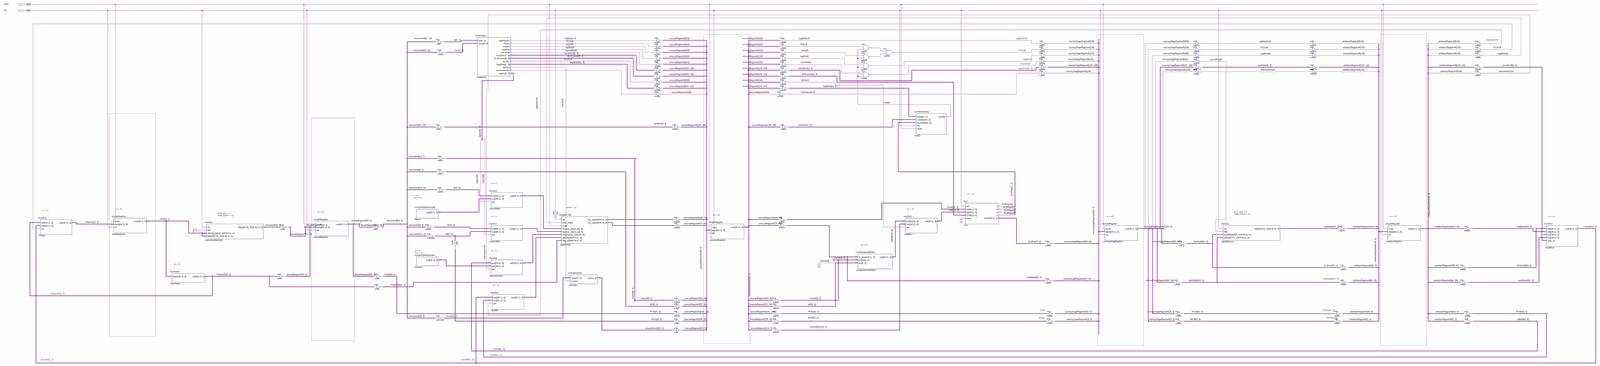
[diagram p0: schematic sheet, whole]
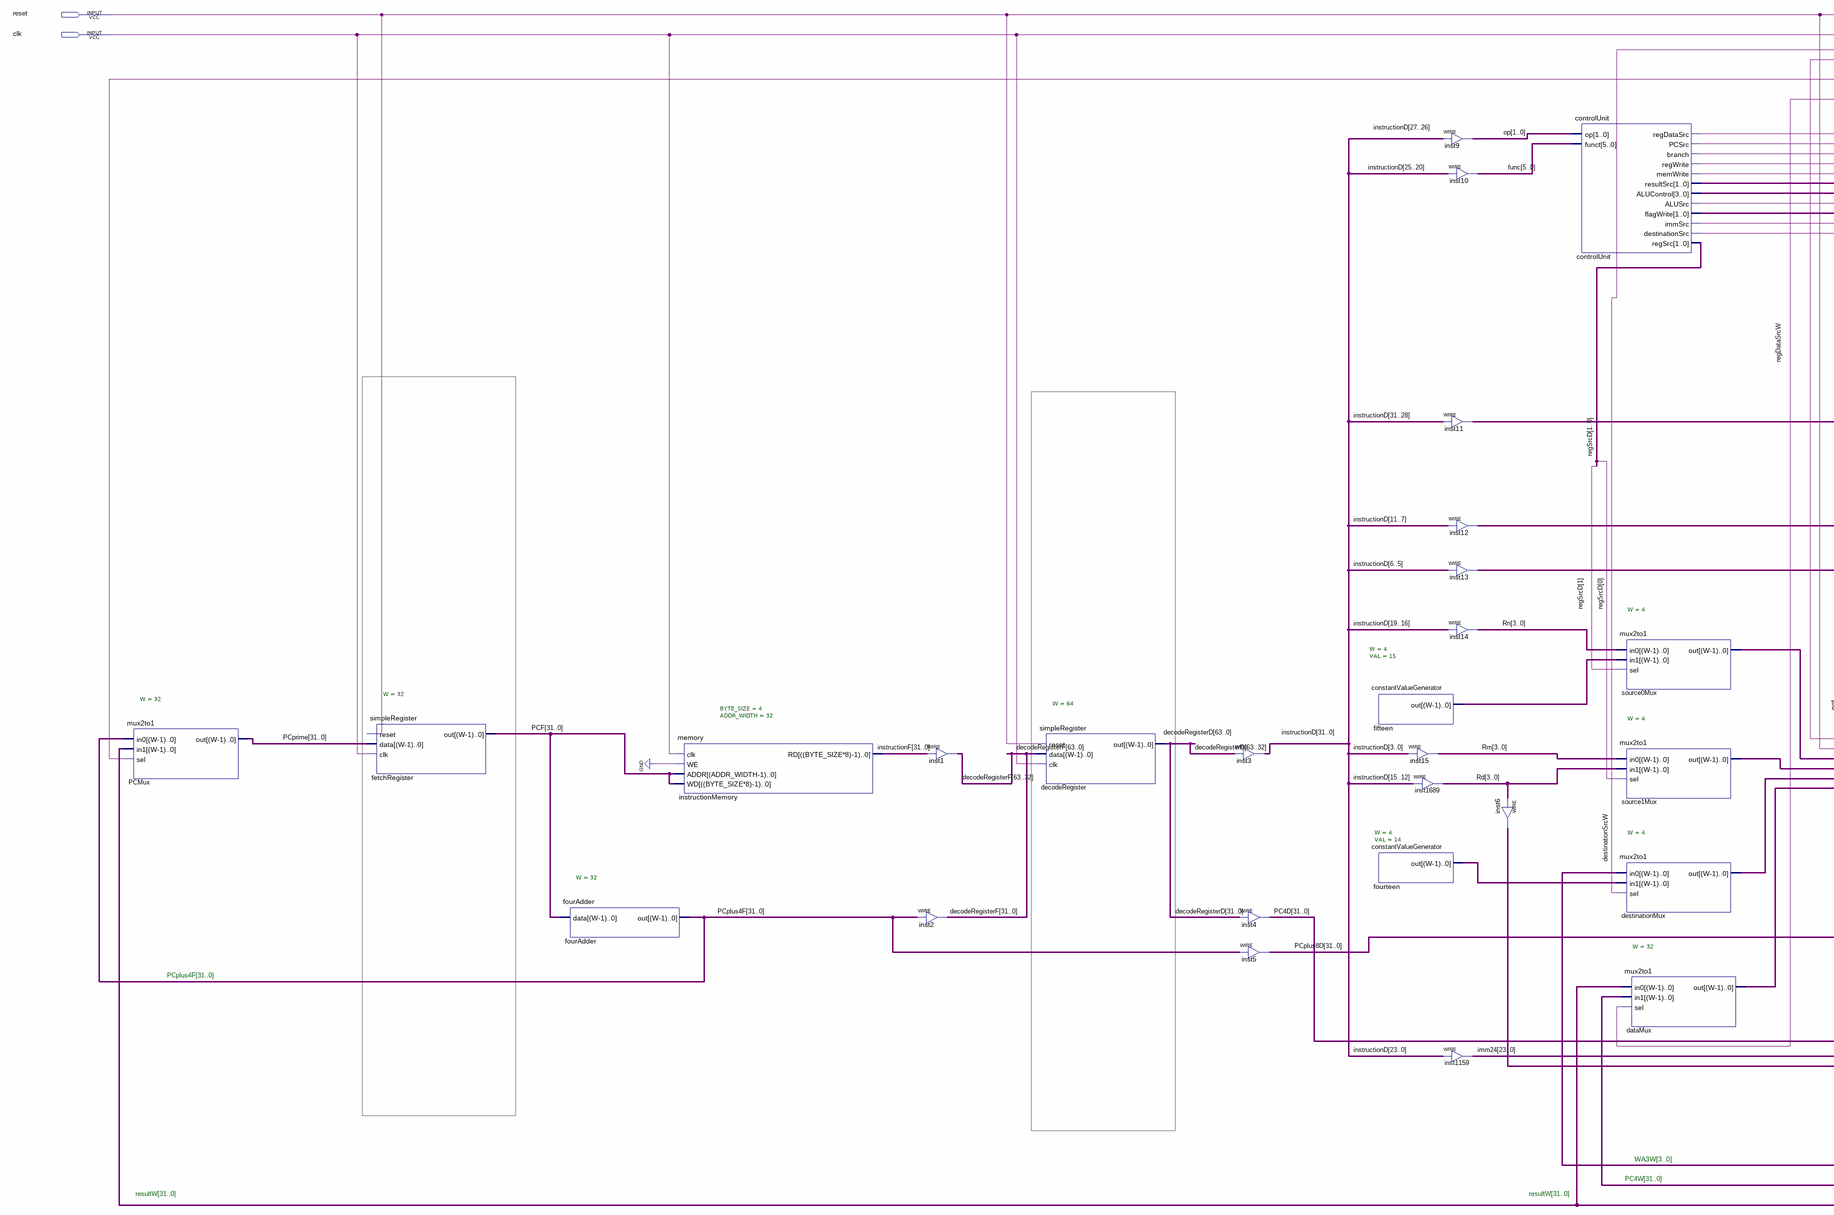
[diagram p1: schematic sheet, left part]
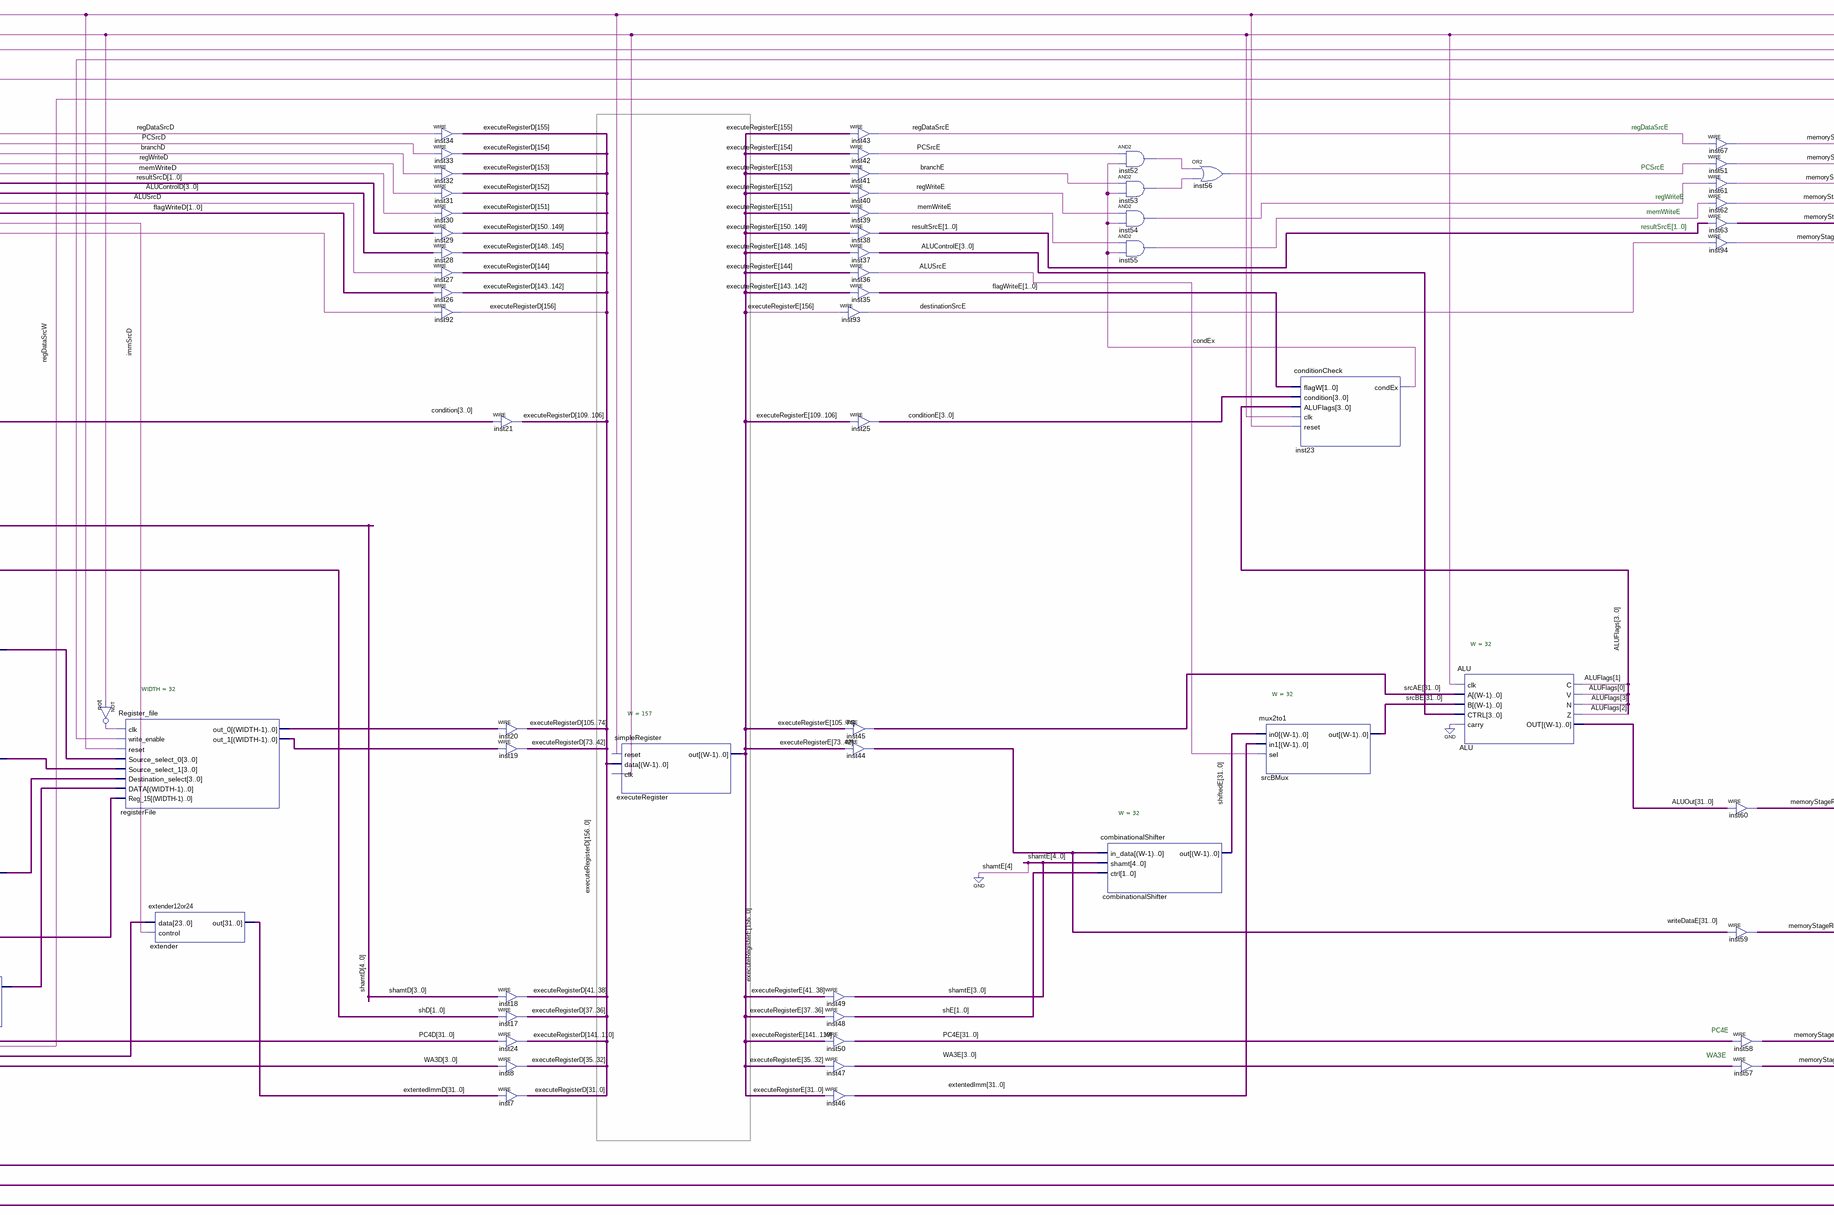
[diagram p2: schematic sheet, centre part]
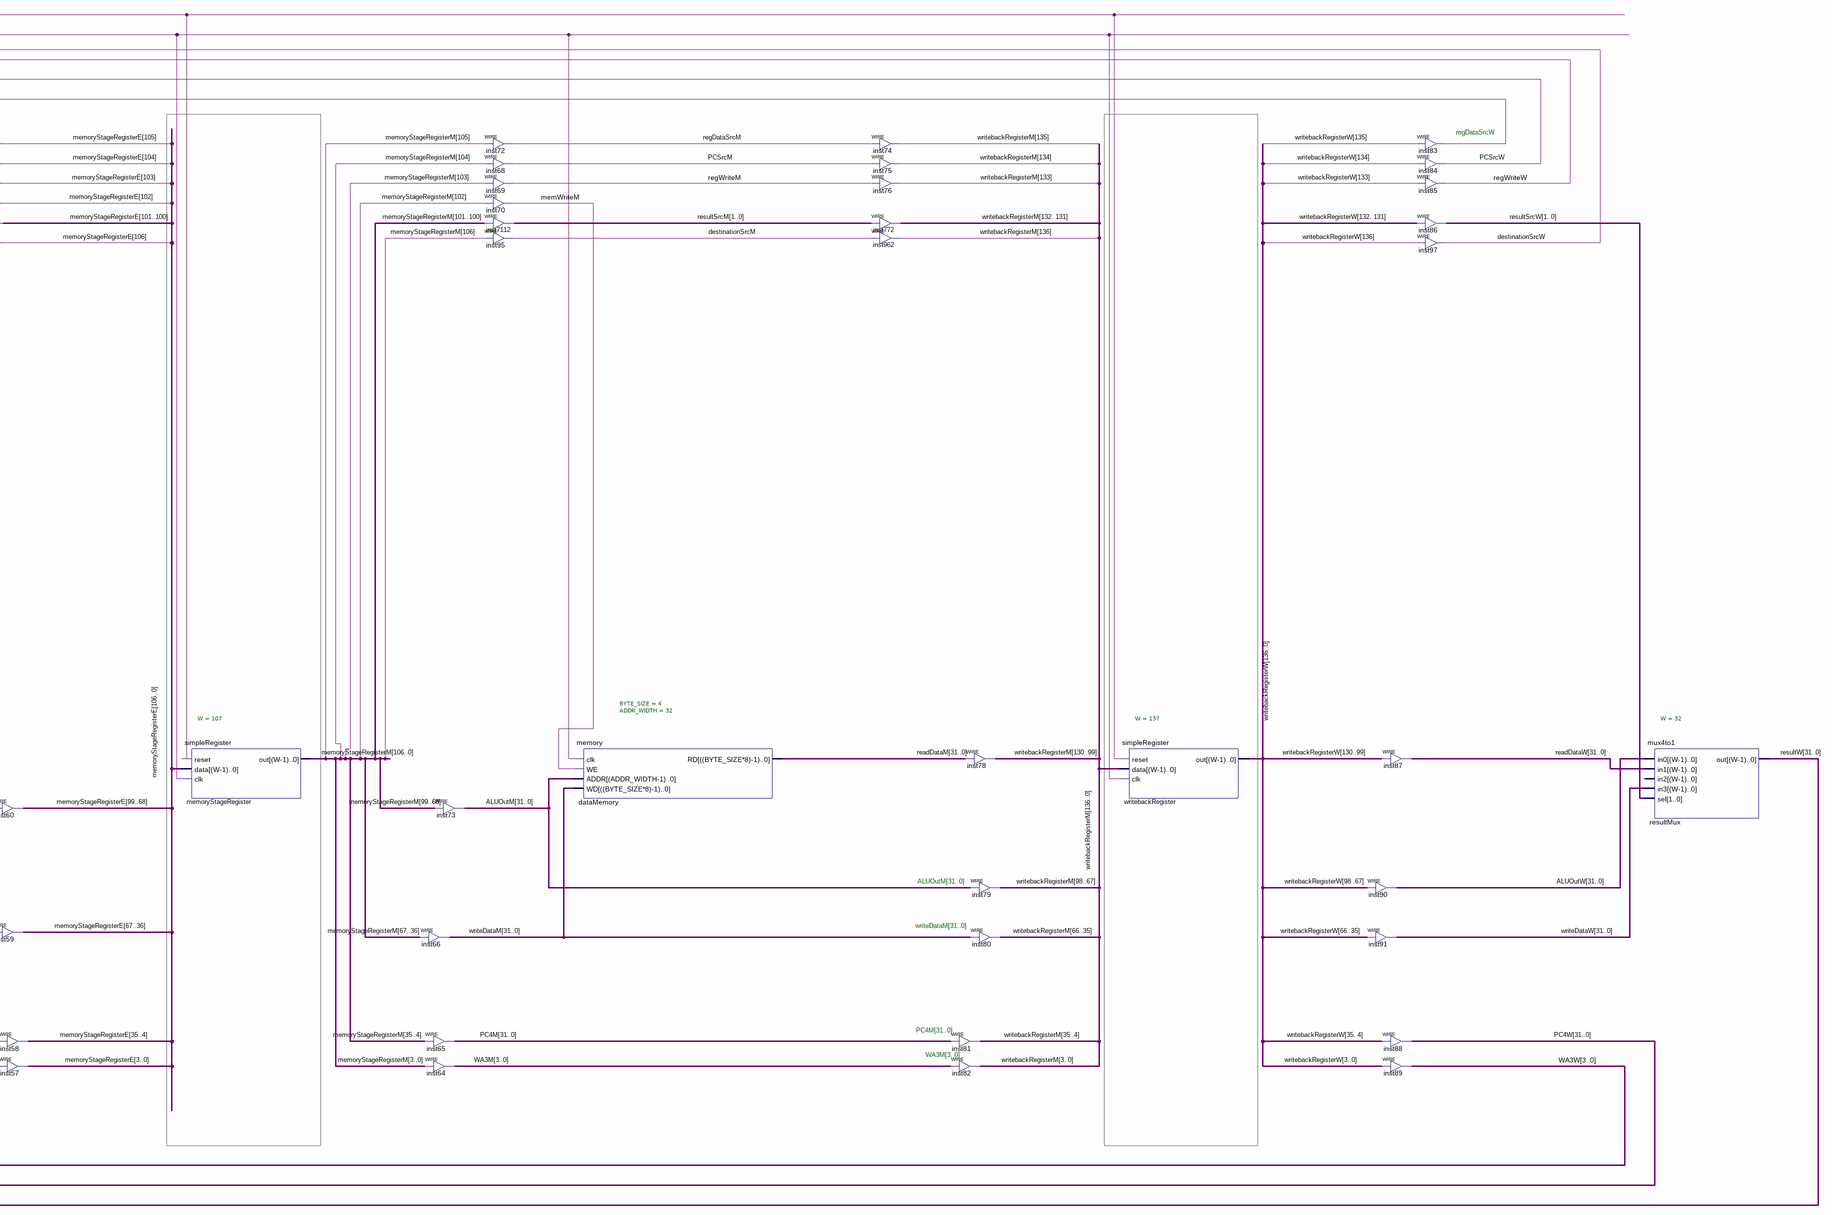
[diagram p3: schematic sheet, right part]
// Quartus schematic pipelineProcessor.bdf as structural Verilog: 120 symbols, 2 pins
module pipelineProcessor (
  input  reset,
  input  clk
);

  wire ALUSrcD, ALUSrcE, branchD, branchE, condEx, controlUnit_destinationsrc, destinationSrcE,
       destinationSrcM, destinationSrcW, immSrcD, inst52_out, inst53_out, inst54_out, inst55_out, inst56_out,
       memWriteD, memWriteE, memWriteM, not_out, PCSrcD, PCSrcE, PCSrcM, PCSrcW, regDataSrcD, regDataSrcE,
       regDataSrcM, regDataSrcW, regWriteD, regWriteE, regWriteM, regWriteW;
  wire [1:0] flagWriteD, flagWriteE, op, regSrcD, resultSrcD, resultSrcE, resultSrcM, resultSrcW, shD, shE;
  wire [3:0] ALUControlD, ALUControlE, ALUFlags, condition, conditionE, destinationMux_out, fifteen_out,
       fourteen_out, Rd, Rm, Rn, shamtE, source0Mux_out, source1Mux_out, WA3D, WA3E, WA3M, WA3W;
  wire [4:0] shamtD;
  wire [5:0] func;
  wire [23:0] imm24;
  wire [31:0] ALUOut, ALUOutM, ALUOutW, dataMux_out, extentedImm, extentedImmD, instructionD, instructionF,
       PC4D, PC4E, PC4M, PC4W, PCF, PCplus4F, PCplus8D, PCprime, readDataM, readDataW, registerFile_out_0,
       registerFile_out_1, resultW, shiftedE, srcAE, srcBE, writeDataE, writeDataM, writeDataW;
  wire [63:0] decodeRegisterD, decodeRegisterF;
  wire [106:0] memoryStageRegisterE, memoryStageRegisterM;
  wire [136:0] writebackRegisterM, writebackRegisterW;
  wire [156:0] executeRegisterD, executeRegisterE;

  mux2to1 #(.W(32)) PCMux (.in0(PCplus4F), .in1(resultW), .sel(PCSrcW), .out(PCprime));
  simpleRegister #(.W(32)) fetchRegister (.reset(reset), .data(PCprime), .clk(clk), .out(PCF));
  fourAdder #(.W(32)) fourAdder (.data(PCF), .out(PCplus4F));
  memory #(.BYTE_SIZE(4), .ADDR_WIDTH(32)) instructionMemory (
    .clk(clk), .WE(1'b0), .ADDR(PCF), .WD(PCF), .RD(instructionF));
  assign decodeRegisterF[31:0] = PCplus4F;  // WIRE inst2
  assign decodeRegisterF[63:32] = instructionF;  // WIRE inst1
  simpleRegister #(.W(64)) decodeRegister (.reset(reset), .data(decodeRegisterF), .clk(clk), .out(decodeRegisterD));
  assign instructionD = decodeRegisterD[63:32];  // WIRE inst3
  assign PC4D = decodeRegisterD[31:0];  // WIRE inst4
  assign PCplus8D = PCplus4F;  // WIRE inst5
  constantValueGenerator #(.W(4), .VAL(15)) fifteen (.out(fifteen_out));
  constantValueGenerator #(.W(4), .VAL(14)) fourteen (.out(fourteen_out));
  assign Rm = instructionD[3:0];  // WIRE inst15
  assign Rd = instructionD[15:12];  // WIRE inst1689
  assign op = instructionD[27:26];  // WIRE inst9
  assign func = instructionD[25:20];  // WIRE inst10
  assign condition = instructionD[31:28];  // WIRE inst11
  assign shamtD = instructionD[11:7];  // WIRE inst12
  assign shD = instructionD[6:5];  // WIRE inst13
  assign Rn = instructionD[19:16];  // WIRE inst14
  assign imm24 = instructionD[23:0];  // WIRE inst1159
  assign WA3D = Rd;  // WIRE inst6
  controlUnit controlUnit (
    .op(op), .funct(func), .regDataSrc(regDataSrcD), .PCSrc(PCSrcD), .branch(branchD), .regWrite(regWriteD),
    .memWrite(memWriteD), .resultSrc(resultSrcD), .ALUControl(ALUControlD), .ALUSrc(ALUSrcD),
    .flagWrite(flagWriteD), .immSrc(immSrcD), .destinationSrc(controlUnit_destinationsrc), .regSrc(regSrcD));
  mux2to1 #(.W(4)) source0Mux (.in0(Rn), .in1(fifteen_out), .sel(regSrcD[1]), .out(source0Mux_out));
  mux2to1 #(.W(4)) source1Mux (.in0(Rm), .in1(Rd), .sel(regSrcD[0]), .out(source1Mux_out));
  mux2to1 #(.W(4)) destinationMux (.in0(WA3W), .in1(fourteen_out), .sel(destinationSrcW), .out(destinationMux_out));
  mux2to1 #(.W(32)) dataMux (.in0(resultW), .in1(PC4W), .sel(regDataSrcW), .out(dataMux_out));
  not \not  (not_out, clk);
  Register_file #(.WIDTH(32)) registerFile (
    .clk(not_out), .write_enable(regWriteW), .reset(reset), .Source_select_0(source0Mux_out),
    .Source_select_1(source1Mux_out), .Destination_select(destinationMux_out), .DATA(dataMux_out),
    .Reg_15(PCplus8D), .out_0(registerFile_out_0), .out_1(registerFile_out_1));
  extender12or24 extender (.data(imm24), .control(immSrcD), .out(extentedImmD));
  assign executeRegisterD[155] = regDataSrcD;  // WIRE inst34
  assign executeRegisterD[154] = PCSrcD;  // WIRE inst33
  assign executeRegisterD[153] = branchD;  // WIRE inst32
  assign executeRegisterD[152] = regWriteD;  // WIRE inst31
  assign executeRegisterD[151] = memWriteD;  // WIRE inst30
  assign executeRegisterD[150:149] = resultSrcD;  // WIRE inst29
  assign executeRegisterD[148:145] = ALUControlD;  // WIRE inst28
  assign executeRegisterD[144] = ALUSrcD;  // WIRE inst27
  assign executeRegisterD[143:142] = flagWriteD;  // WIRE inst26
  assign executeRegisterD[156] = controlUnit_destinationsrc;  // WIRE inst92
  assign executeRegisterD[109:106] = condition;  // WIRE inst21
  assign executeRegisterD[105:74] = registerFile_out_0;  // WIRE inst20
  assign executeRegisterD[73:42] = registerFile_out_1;  // WIRE inst19
  assign executeRegisterD[41:38] = shamtD[3:0];  // WIRE inst18
  assign executeRegisterD[37:36] = shD;  // WIRE inst17
  assign executeRegisterD[141:110] = PC4D;  // WIRE inst24
  assign executeRegisterD[35:32] = WA3D;  // WIRE inst8
  assign executeRegisterD[31:0] = extentedImmD;  // WIRE inst7
  simpleRegister #(.W(157)) executeRegister (.reset(reset), .data(executeRegisterD), .clk(clk), .out(executeRegisterE));
  assign regDataSrcE = executeRegisterE[155];  // WIRE inst43
  assign PCSrcE = executeRegisterE[154];  // WIRE inst42
  assign branchE = executeRegisterE[153];  // WIRE inst41
  assign regWriteE = executeRegisterE[152];  // WIRE inst40
  assign memWriteE = executeRegisterE[151];  // WIRE inst39
  assign resultSrcE = executeRegisterE[150:149];  // WIRE inst38
  assign ALUControlE = executeRegisterE[148:145];  // WIRE inst37
  assign ALUSrcE = executeRegisterE[144];  // WIRE inst36
  assign flagWriteE = executeRegisterE[143:142];  // WIRE inst35
  assign destinationSrcE = executeRegisterE[156];  // WIRE inst93
  assign conditionE = executeRegisterE[109:106];  // WIRE inst25
  assign srcAE = executeRegisterE[105:74];  // WIRE inst45
  assign writeDataE = executeRegisterE[73:42];  // WIRE inst44
  assign shamtE = executeRegisterE[41:38];  // WIRE inst49
  assign shE = executeRegisterE[37:36];  // WIRE inst48
  assign PC4E = executeRegisterE[141:110];  // WIRE inst50
  assign WA3E = executeRegisterE[35:32];  // WIRE inst47
  assign extentedImm = executeRegisterE[31:0];  // WIRE inst46
  and inst52 (inst52_out, PCSrcE, condEx);
  and inst53 (inst53_out, branchE, condEx);
  and inst54 (inst54_out, regWriteE, condEx);
  and inst55 (inst55_out, memWriteE, condEx);
  combinationalShifter #(.W(32)) combinationalShifter (
    .in_data(writeDataE), .shamt({1'b0, shamtE}), .ctrl(shE), .out(shiftedE));
  or inst56 (inst56_out, inst52_out, inst53_out);
  mux2to1 #(.W(32)) srcBMux (.in0(shiftedE), .in1(extentedImm), .sel(ALUSrcE), .out(srcBE));
  conditionCheck inst23 (
    .flagW(flagWriteE), .condition(conditionE), .ALUFlags(ALUFlags), .clk(clk), .reset(reset), .condEx(condEx));
  ALU #(.W(32)) ALU (
    .clk(clk), .A(srcAE), .B(srcBE), .CTRL(ALUControlE), .carry(1'b0), .C(ALUFlags[1]), .V(ALUFlags[0]),
    .N(ALUFlags[3]), .Z(ALUFlags[2]), .OUT(ALUOut));
  assign memoryStageRegisterE[105] = regDataSrcE;  // WIRE inst67
  assign memoryStageRegisterE[104] = inst56_out;  // WIRE inst51
  assign memoryStageRegisterE[103] = inst54_out;  // WIRE inst61
  assign memoryStageRegisterE[102] = inst55_out;  // WIRE inst62
  assign memoryStageRegisterE[101:100] = resultSrcE;  // WIRE inst63
  assign memoryStageRegisterE[106] = destinationSrcE;  // WIRE inst94
  assign memoryStageRegisterE[99:68] = ALUOut;  // WIRE inst60
  assign memoryStageRegisterE[67:36] = writeDataE;  // WIRE inst59
  assign memoryStageRegisterE[35:4] = PC4E;  // WIRE inst58
  assign memoryStageRegisterE[3:0] = WA3E;  // WIRE inst57
  simpleRegister #(.W(107)) memoryStageRegister (
    .reset(reset), .data(memoryStageRegisterE), .clk(clk), .out(memoryStageRegisterM));
  assign writeDataM = memoryStageRegisterM[67:36];  // WIRE inst66
  assign PC4M = memoryStageRegisterM[35:4];  // WIRE inst65
  assign WA3M = memoryStageRegisterM[3:0];  // WIRE inst64
  assign ALUOutM = memoryStageRegisterM[99:68];  // WIRE inst73
  assign regDataSrcM = memoryStageRegisterM[105];  // WIRE inst72
  assign PCSrcM = memoryStageRegisterM[104];  // WIRE inst68
  assign regWriteM = memoryStageRegisterM[103];  // WIRE inst69
  assign memWriteM = memoryStageRegisterM[102];  // WIRE inst70
  assign resultSrcM = memoryStageRegisterM[101:100];  // WIRE inst7112
  assign destinationSrcM = memoryStageRegisterM[106];  // WIRE inst95
  memory #(.BYTE_SIZE(4), .ADDR_WIDTH(32)) dataMemory (
    .clk(clk), .WE(memWriteM), .ADDR(ALUOutM), .WD(writeDataM), .RD(readDataM));
  assign writebackRegisterM[135] = regDataSrcM;  // WIRE inst74
  assign writebackRegisterM[134] = PCSrcM;  // WIRE inst75
  assign writebackRegisterM[133] = regWriteM;  // WIRE inst76
  assign writebackRegisterM[132:131] = resultSrcM;  // WIRE inst772
  assign writebackRegisterM[136] = destinationSrcM;  // WIRE inst962
  assign writebackRegisterM[130:99] = readDataM;  // WIRE inst78
  assign writebackRegisterM[98:67] = ALUOutM;  // WIRE inst79
  assign writebackRegisterM[66:35] = writeDataM;  // WIRE inst80
  assign writebackRegisterM[35:4] = PC4M;  // WIRE inst81
  assign writebackRegisterM[3:0] = WA3M;  // WIRE inst82
  simpleRegister #(.W(137)) writebackRegister (
    .reset(reset), .data(writebackRegisterM), .clk(clk), .out(writebackRegisterW));
  assign ALUOutW = writebackRegisterW[98:67];  // WIRE inst90
  assign writeDataW = writebackRegisterW[66:35];  // WIRE inst91
  assign regDataSrcW = writebackRegisterW[135];  // WIRE inst83
  assign PCSrcW = writebackRegisterW[134];  // WIRE inst84
  assign regWriteW = writebackRegisterW[133];  // WIRE inst85
  assign resultSrcW = writebackRegisterW[132:131];  // WIRE inst86
  assign destinationSrcW = writebackRegisterW[136];  // WIRE inst97
  assign readDataW = writebackRegisterW[130:99];  // WIRE inst87
  assign PC4W = writebackRegisterW[35:4];  // WIRE inst88
  assign WA3W = writebackRegisterW[3:0];  // WIRE inst89
  mux4to1 #(.W(32)) resultMux (
    .in0(ALUOutW), .in1(readDataW), .in3(writeDataW), .sel(resultSrcW), .out(resultW));  // open: in2

  // Notes on the sheet:
  //   regDataSrcE
  //   regDataSrcW
  //   PCSrcE
  //   regWriteE
  //   memWriteE
  //   resultSrcE[1..0]
  //   ALUOutM[31..0]
  //   writeDataM[31..0]
  //   PCplus4F[31..0]
  //   PC4E
  //   PC4M[31..0]
  //   WA3E
  //   WA3M[3..0]
  //   WA3W[3..0]
  //   PC4W[31..0]
  //   resultW[31..0]
  //   resultW[31..0]
endmodule
